# Altium schematic sheet Pressure_INPUT.SchDoc
size A3
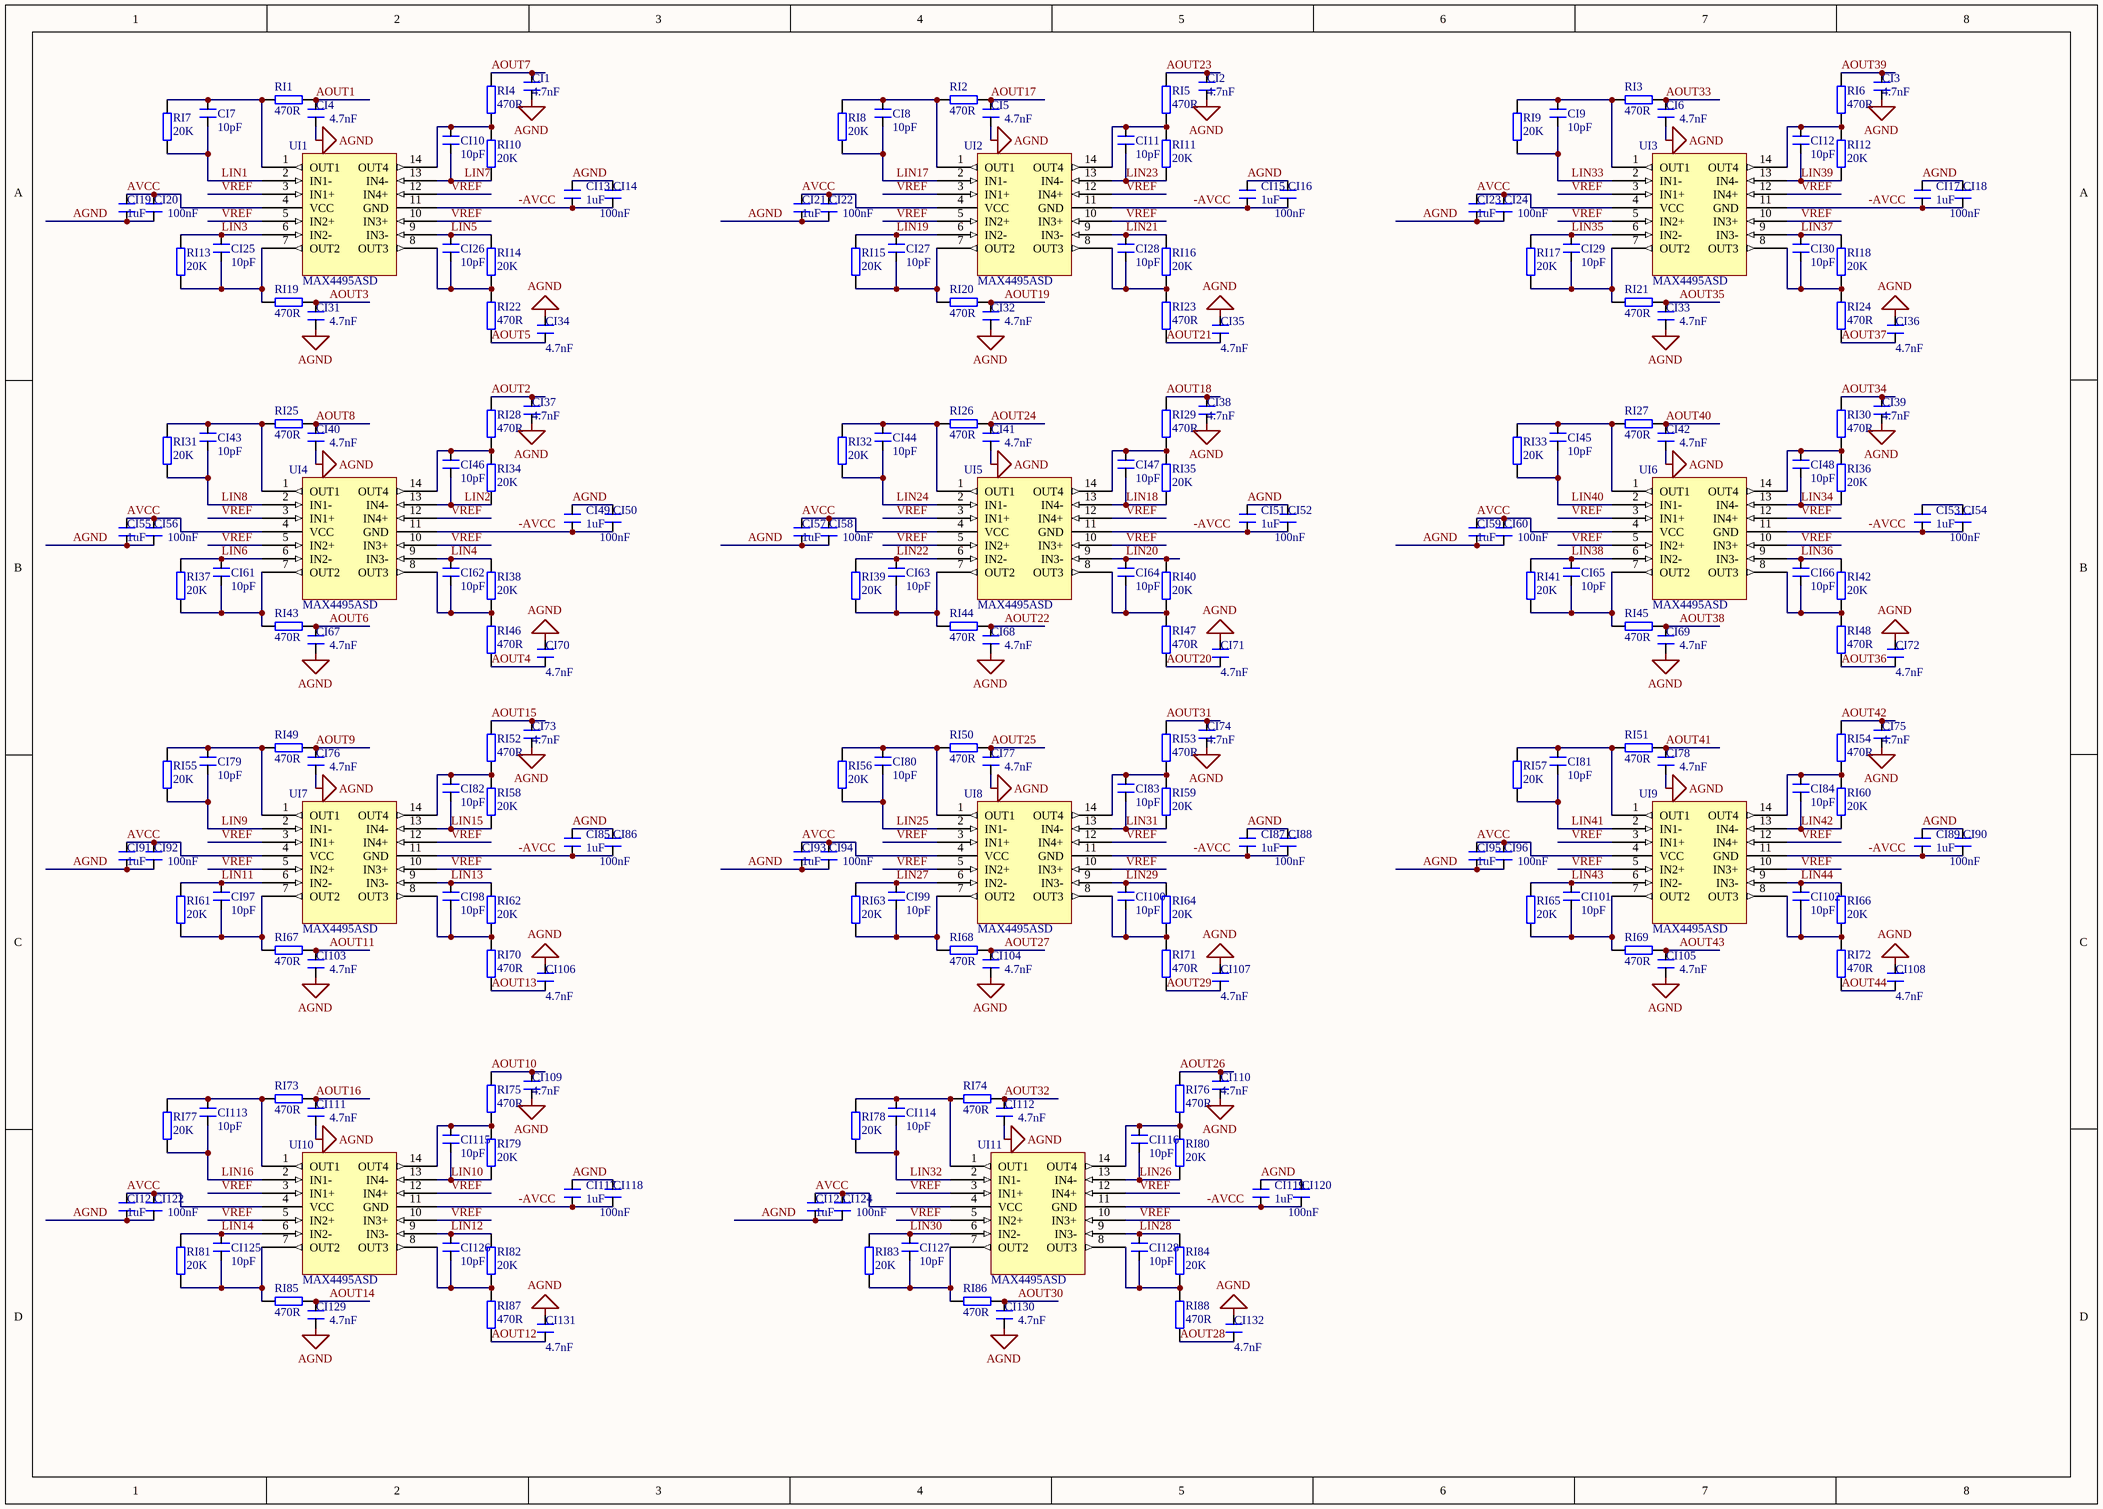
[diagram p0: Pressure_INPUT.SchDoc]

## Parts
CI1  4.7nF  [C0603_HSC100]
CI2  4.7nF  [C0603_HSC100]
CI3  4.7nF  [C0603_HSC100]
CI4  4.7nF  [C0603_HSC100]
CI5  4.7nF  [C0603_HSC100]
CI6  4.7nF  [C0603_HSC100]
CI7  10pF  [C0603_HSC100]
CI8  10pF  [C0603_HSC100]
CI9  10pF  [C0603_HSC100]
CI10  10pF  [C0603_HSC100]
CI11  10pF  [C0603_HSC100]
CI12  10pF  [C0603_HSC100]
CI13  1uF  [C0603_HSC100]
CI14  100nF  [C0603_HSC100]
CI15  1uF  [C0603_HSC100]
CI16  100nF  [C0603_HSC100]
CI17  1uF  [C0603_HSC100]
CI18  100nF  [C0603_HSC100]
CI19  1uF  [C0603_HSC100]
CI20  100nF  [C0603_HSC100]
CI21  1uF  [C0603_HSC100]
CI22  100nF  [C0603_HSC100]
CI23  1uF  [C0603_HSC100]
CI24  100nF  [C0603_HSC100]
CI25  10pF  [C0603_HSC100]
CI26  10pF  [C0603_HSC100]
CI27  10pF  [C0603_HSC100]
CI28  10pF  [C0603_HSC100]
CI29  10pF  [C0603_HSC100]
CI30  10pF  [C0603_HSC100]
CI31  4.7nF  [C0603_HSC100]
CI32  4.7nF  [C0603_HSC100]
CI33  4.7nF  [C0603_HSC100]
CI34  4.7nF  [C0603_HSC100]
CI35  4.7nF  [C0603_HSC100]
CI36  4.7nF  [C0603_HSC100]
CI37  4.7nF  [C0603_HSC100]
CI38  4.7nF  [C0603_HSC100]
CI39  4.7nF  [C0603_HSC100]
CI40  4.7nF  [C0603_HSC100]
CI41  4.7nF  [C0603_HSC100]
CI42  4.7nF  [C0603_HSC100]
CI43  10pF  [C0603_HSC100]
CI44  10pF  [C0603_HSC100]
CI45  10pF  [C0603_HSC100]
CI46  10pF  [C0603_HSC100]
CI47  10pF  [C0603_HSC100]
CI48  10pF  [C0603_HSC100]
CI49  1uF  [C0603_HSC100]
CI50  100nF  [C0603_HSC100]
CI51  1uF  [C0603_HSC100]
CI52  100nF  [C0603_HSC100]
CI53  1uF  [C0603_HSC100]
CI54  100nF  [C0603_HSC100]
CI55  1uF  [C0603_HSC100]
CI56  100nF  [C0603_HSC100]
CI57  1uF  [C0603_HSC100]
CI58  100nF  [C0603_HSC100]
CI59  1uF  [C0603_HSC100]
CI60  100nF  [C0603_HSC100]
CI61  10pF  [C0603_HSC100]
CI62  10pF  [C0603_HSC100]
CI63  10pF  [C0603_HSC100]
CI64  10pF  [C0603_HSC100]
CI65  10pF  [C0603_HSC100]
CI66  10pF  [C0603_HSC100]
CI67  4.7nF  [C0603_HSC100]
CI68  4.7nF  [C0603_HSC100]
CI69  4.7nF  [C0603_HSC100]
CI70  4.7nF  [C0603_HSC100]
CI71  4.7nF  [C0603_HSC100]
CI72  4.7nF  [C0603_HSC100]
CI73  4.7nF  [C0603_HSC100]
CI74  4.7nF  [C0603_HSC100]
CI75  4.7nF  [C0603_HSC100]
CI76  4.7nF  [C0603_HSC100]
CI77  4.7nF  [C0603_HSC100]
CI78  4.7nF  [C0603_HSC100]
CI79  10pF  [C0603_HSC100]
CI80  10pF  [C0603_HSC100]
CI81  10pF  [C0603_HSC100]
CI82  10pF  [C0603_HSC100]
CI83  10pF  [C0603_HSC100]
CI84  10pF  [C0603_HSC100]
CI85  1uF  [C0603_HSC100]
CI86  100nF  [C0603_HSC100]
CI87  1uF  [C0603_HSC100]
CI88  100nF  [C0603_HSC100]
CI89  1uF  [C0603_HSC100]
CI90  100nF  [C0603_HSC100]
CI91  1uF  [C0603_HSC100]
CI92  100nF  [C0603_HSC100]
CI93  1uF  [C0603_HSC100]
CI94  100nF  [C0603_HSC100]
CI95  1uF  [C0603_HSC100]
CI96  100nF  [C0603_HSC100]
CI97  10pF  [C0603_HSC100]
CI98  10pF  [C0603_HSC100]
CI99  10pF  [C0603_HSC100]
CI100  10pF  [C0603_HSC100]
CI101  10pF  [C0603_HSC100]
CI102  10pF  [C0603_HSC100]
CI103  4.7nF  [C0603_HSC100]
CI104  4.7nF  [C0603_HSC100]
CI105  4.7nF  [C0603_HSC100]
CI106  4.7nF  [C0603_HSC100]
CI107  4.7nF  [C0603_HSC100]
CI108  4.7nF  [C0603_HSC100]
CI109  4.7nF  [C0603_HSC100]
CI110  4.7nF  [C0603_HSC100]
CI111  4.7nF  [C0603_HSC100]
CI112  4.7nF  [C0603_HSC100]
CI113  10pF  [C0603_HSC100]
CI114  10pF  [C0603_HSC100]
CI115  10pF  [C0603_HSC100]
CI116  10pF  [C0603_HSC100]
CI117  1uF  [C0603_HSC100]
CI118  100nF  [C0603_HSC100]
CI119  1uF  [C0603_HSC100]
CI120  100nF  [C0603_HSC100]
CI121  1uF  [C0603_HSC100]
CI122  100nF  [C0603_HSC100]
CI123  1uF  [C0603_HSC100]
CI124  100nF  [C0603_HSC100]
CI125  10pF  [C0603_HSC100]
CI126  10pF  [C0603_HSC100]
CI127  10pF  [C0603_HSC100]
CI128  10pF  [C0603_HSC100]
CI129  4.7nF  [C0603_HSC100]
CI130  4.7nF  [C0603_HSC100]
CI131  4.7nF  [C0603_HSC100]
CI132  4.7nF  [C0603_HSC100]
RI1  470R  [R0603_HSC100]
RI2  470R  [R0603_HSC100]
RI3  470R  [R0603_HSC100]
RI4  470R  [R0603_HSC100]
RI5  470R  [R0603_HSC100]
RI6  470R  [R0603_HSC100]
RI7  20K  [R0603_HSC100]
RI8  20K  [R0603_HSC100]
RI9  20K  [R0603_HSC100]
RI10  20K  [R0603_HSC100]
RI11  20K  [R0603_HSC100]
RI12  20K  [R0603_HSC100]
RI13  20K  [R0603_HSC100]
RI14  20K  [R0603_HSC100]
RI15  20K  [R0603_HSC100]
RI16  20K  [R0603_HSC100]
RI17  20K  [R0603_HSC100]
RI18  20K  [R0603_HSC100]
RI19  470R  [R0603_HSC100]
RI20  470R  [R0603_HSC100]
RI21  470R  [R0603_HSC100]
RI22  470R  [R0603_HSC100]
RI23  470R  [R0603_HSC100]
RI24  470R  [R0603_HSC100]
RI25  470R  [R0603_HSC100]
RI26  470R  [R0603_HSC100]
RI27  470R  [R0603_HSC100]
RI28  470R  [R0603_HSC100]
RI29  470R  [R0603_HSC100]
RI30  470R  [R0603_HSC100]
RI31  20K  [R0603_HSC100]
RI32  20K  [R0603_HSC100]
RI33  20K  [R0603_HSC100]
RI34  20K  [R0603_HSC100]
RI35  20K  [R0603_HSC100]
RI36  20K  [R0603_HSC100]
RI37  20K  [R0603_HSC100]
RI38  20K  [R0603_HSC100]
RI39  20K  [R0603_HSC100]
RI40  20K  [R0603_HSC100]
RI41  20K  [R0603_HSC100]
RI42  20K  [R0603_HSC100]
RI43  470R  [R0603_HSC100]
RI44  470R  [R0603_HSC100]
RI45  470R  [R0603_HSC100]
RI46  470R  [R0603_HSC100]
RI47  470R  [R0603_HSC100]
RI48  470R  [R0603_HSC100]
RI49  470R  [R0603_HSC100]
RI50  470R  [R0603_HSC100]
RI51  470R  [R0603_HSC100]
RI52  470R  [R0603_HSC100]
RI53  470R  [R0603_HSC100]
RI54  470R  [R0603_HSC100]
RI55  20K  [R0603_HSC100]
RI56  20K  [R0603_HSC100]
RI57  20K  [R0603_HSC100]
RI58  20K  [R0603_HSC100]
RI59  20K  [R0603_HSC100]
RI60  20K  [R0603_HSC100]
RI61  20K  [R0603_HSC100]
RI62  20K  [R0603_HSC100]
RI63  20K  [R0603_HSC100]
RI64  20K  [R0603_HSC100]
RI65  20K  [R0603_HSC100]
RI66  20K  [R0603_HSC100]
RI67  470R  [R0603_HSC100]
RI68  470R  [R0603_HSC100]
RI69  470R  [R0603_HSC100]
RI70  470R  [R0603_HSC100]
RI71  470R  [R0603_HSC100]
RI72  470R  [R0603_HSC100]
RI73  470R  [R0603_HSC100]
RI74  470R  [R0603_HSC100]
RI75  470R  [R0603_HSC100]
RI76  470R  [R0603_HSC100]
RI77  20K  [R0603_HSC100]
RI78  20K  [R0603_HSC100]
RI79  20K  [R0603_HSC100]
RI80  20K  [R0603_HSC100]
RI81  20K  [R0603_HSC100]
RI82  20K  [R0603_HSC100]
RI83  20K  [R0603_HSC100]
RI84  20K  [R0603_HSC100]
RI85  470R  [R0603_HSC100]
RI86  470R  [R0603_HSC100]
RI87  470R  [R0603_HSC100]
RI88  470R  [R0603_HSC100]
UI1  MAX4495ASD  [SO-14]
UI2  MAX4495ASD  [SO-14]
UI3  MAX4495ASD  [SO-14]
UI4  MAX4495ASD  [SO-14]
UI5  MAX4495ASD  [SO-14]
UI6  MAX4495ASD  [SO-14]
UI7  MAX4495ASD  [SO-14]
UI8  MAX4495ASD  [SO-14]
UI9  MAX4495ASD  [SO-14]
UI10  MAX4495ASD  [SO-14]
UI11  MAX4495ASD  [SO-14]

## Nets
AGND: CI1.2 CI2.2 CI3.2 CI4.2 CI5.2 CI6.2 CI13.1 CI14.1 CI15.1 CI16.1 CI17.1 CI18.1 CI19.2 CI20.2 CI21.2 CI22.2 CI23.2 CI24.2 CI31.2 CI32.2 CI33.2 CI34.1 CI35.1 CI36.1 CI37.2 CI38.2 CI39.2 CI40.2 CI41.2 CI42.2 CI49.1 CI50.1 CI51.1 CI52.1 CI55.2 CI56.2 CI57.2 CI58.2 CI59.2 CI60.2 CI67.2 CI68.2 CI69.2 CI70.1 CI71.1 CI72.1 CI73.2 CI74.2 CI75.2 CI76.2 CI77.2 CI78.2 CI85.1 CI86.1 CI87.1 CI88.1 CI89.1 CI90.1 CI91.2 CI92.2 CI93.2 CI94.2 CI95.2 CI96.2 CI103.2 CI104.2 CI105.2 CI106.1 CI107.1 CI108.1 CI109.2 CI110.2 CI111.2 CI112.2 CI117.1 CI118.1 CI119.1 CI120.1 CI121.2 CI122.2 CI123.2 CI124.2 CI129.2 CI130.2 CI131.1 CI132.1
-AVCC: CI13.2 CI14.2 CI15.2 CI16.2 CI17.2 CI18.2 CI49.2 CI50.2 CI51.2 CI52.2 CI53.2 CI54.2 CI85.2 CI86.2 CI87.2 CI88.2 CI89.2 CI90.2 CI117.2 CI118.2 CI119.2 CI120.2 UI1.11(GND) UI2.11(GND) UI3.11(GND) UI4.11(GND) UI5.11(GND) UI6.11(GND) UI7.11(GND) UI8.11(GND) UI9.11(GND) UI10.11(GND) UI11.11(GND)
AOUT1: CI4.1 RI1.1
AOUT2: CI37.1 RI28.2
AOUT3: CI31.1 RI19.1
AOUT4: CI70.2 RI46.2
AOUT5: CI34.2 RI22.2
AOUT6: CI67.1 RI43.1
AOUT7: CI1.1 RI4.2
AOUT8: CI40.1 RI25.1
AOUT9: CI76.1 RI49.1
AOUT10: CI109.1 RI75.2
AOUT11: CI103.1 RI67.1
AOUT12: CI131.2 RI87.2
AOUT13: CI106.2 RI70.2
AOUT14: CI129.1 RI85.1
AOUT15: CI73.1 RI52.2
AOUT16: CI111.1 RI73.1
AOUT17: CI5.1 RI2.1
AOUT18: CI38.1 RI29.2
AOUT19: CI32.1 RI20.1
AOUT20: CI71.2 RI47.2
AOUT21: CI35.2 RI23.2
AOUT22: CI68.1 RI44.1
AOUT23: CI2.1 RI5.2
AOUT24: CI41.1 RI26.1
AOUT25: CI77.1 RI50.1
AOUT26: CI110.1 RI76.2
AOUT27: CI104.1 RI68.1
AOUT28: CI132.2 RI88.2
AOUT29: CI107.2 RI71.2
AOUT30: CI130.1 RI86.1
AOUT31: CI74.1 RI53.2
AOUT32: CI112.1 RI74.1
AOUT33: CI6.1 RI3.1
AOUT34: CI39.1 RI30.2
AOUT35: CI33.1 RI21.1
AOUT36: CI72.2 RI48.2
AOUT37: CI36.2 RI24.2
AOUT38: CI69.1 RI45.1
AOUT39: CI3.1 RI6.2
AOUT40: CI42.1 RI27.1
AOUT41: CI78.1 RI51.1
AOUT42: CI75.1 RI54.2
AOUT43: CI105.1 RI69.1
AOUT44: CI108.2 RI72.2
AVCC: CI19.1 CI20.1 CI21.1 CI22.1 CI23.1 CI24.1 CI55.1 CI56.1 CI57.1 CI58.1 CI59.1 CI60.1 CI91.1 CI92.1 CI93.1 CI94.1 CI95.1 CI96.1 CI121.1 CI122.1 CI123.1 CI124.1 UI1.4(VCC) UI2.4(VCC) UI3.4(VCC) UI4.4(VCC) UI5.4(VCC) UI6.4(VCC) UI7.4(VCC) UI8.4(VCC) UI9.4(VCC) UI10.4(VCC) UI11.4(VCC)
LIN1: CI7.2 RI7.1 UI1.2(IN1-)
LIN2: CI46.2 RI34.1 UI4.13(IN4-)
LIN3: CI25.1 RI13.1 UI1.6(IN2-)
LIN4: CI62.1 RI38.2 UI4.9(IN3-)
LIN5: CI26.1 RI14.2 UI1.9(IN3-)
LIN6: CI61.1 RI37.1 UI4.6(IN2-)
LIN7: CI10.2 RI10.1 UI1.13(IN4-)
LIN8: CI43.2 RI31.1 UI4.2(IN1-)
LIN9: CI79.2 RI55.1 UI7.2(IN1-)
LIN10: CI115.2 RI79.1 UI10.13(IN4-)
LIN11: CI97.1 RI61.1 UI7.6(IN2-)
LIN12: CI126.1 RI82.2 UI10.9(IN3-)
LIN13: CI98.1 RI62.2 UI7.9(IN3-)
LIN14: CI125.1 RI81.1 UI10.6(IN2-)
LIN15: CI82.2 RI58.1 UI7.13(IN4-)
LIN16: CI113.2 RI77.1 UI10.2(IN1-)
LIN17: CI8.2 RI8.1 UI2.2(IN1-)
LIN18: CI47.2 RI35.1 UI5.13(IN4-)
LIN19: CI27.1 RI15.1 UI2.6(IN2-)
LIN20: CI64.1 RI40.2 UI5.9(IN3-)
LIN21: CI28.1 RI16.2 UI2.9(IN3-)
LIN22: CI63.1 RI39.1 UI5.6(IN2-)
LIN23: CI11.2 RI11.1 UI2.13(IN4-)
LIN24: CI44.2 RI32.1 UI5.2(IN1-)
LIN25: CI80.2 RI56.1 UI8.2(IN1-)
LIN26: CI116.2 RI80.1 UI11.13(IN4-)
LIN27: CI99.1 RI63.1 UI8.6(IN2-)
LIN28: CI128.1 RI84.2 UI11.9(IN3-)
LIN29: CI100.1 RI64.2 UI8.9(IN3-)
LIN30: CI127.1 RI83.1 UI11.6(IN2-)
LIN31: CI83.2 RI59.1 UI8.13(IN4-)
LIN32: CI114.2 RI78.1 UI11.2(IN1-)
LIN33: CI9.2 RI9.1 UI3.2(IN1-)
LIN34: CI48.2 RI36.1 UI6.13(IN4-)
LIN35: CI29.1 RI17.1 UI3.6(IN2-)
LIN36: CI66.1 RI42.2 UI6.9(IN3-)
LIN37: CI30.1 RI18.2 UI3.9(IN3-)
LIN38: CI65.1 RI41.1 UI6.6(IN2-)
LIN39: CI12.2 RI12.1 UI3.13(IN4-)
LIN40: CI45.2 RI33.1 UI6.2(IN1-)
LIN41: CI81.2 RI57.1 UI9.2(IN1-)
LIN42: CI84.2 RI60.1 UI9.13(IN4-)
LIN43: CI101.1 RI65.1 UI9.6(IN2-)
LIN44: CI102.1 RI66.2 UI9.9(IN3-)
VREF: UI1.3(IN1+) UI1.5(IN2+) UI1.10(IN3+) UI1.12(IN4+) UI2.3(IN1+) UI2.5(IN2+) UI2.10(IN3+) UI2.12(IN4+) UI3.3(IN1+) UI3.5(IN2+) UI3.10(IN3+) UI3.12(IN4+) UI4.3(IN1+) UI4.5(IN2+) UI4.10(IN3+) UI4.12(IN4+) UI5.3(IN1+) UI5.5(IN2+) UI5.10(IN3+) UI5.12(IN4+) UI6.3(IN1+) UI6.5(IN2+) UI6.10(IN3+) UI6.12(IN4+) UI7.3(IN1+) UI7.5(IN2+) UI7.10(IN3+) UI7.12(IN4+) UI8.3(IN1+) UI8.5(IN2+) UI8.10(IN3+) UI8.12(IN4+) UI9.3(IN1+) UI9.5(IN2+) UI9.10(IN3+) UI9.12(IN4+) UI10.3(IN1+) UI10.5(IN2+) UI10.10(IN3+) UI10.12(IN4+) UI11.3(IN1+) UI11.5(IN2+) UI11.10(IN3+) UI11.12(IN4+)
NetCI7_1: CI7.1 RI1.2 RI7.2 UI1.1(OUT1)
NetCI8_1: CI8.1 RI2.2 RI8.2 UI2.1(OUT1)
NetCI9_1: CI9.1 RI3.2 RI9.2 UI3.1(OUT1)
NetCI10_1: CI10.1 RI4.1 RI10.2 UI1.14(OUT4)
NetCI11_1: CI11.1 RI5.1 RI11.2 UI2.14(OUT4)
NetCI12_1: CI12.1 RI6.1 RI12.2 UI3.14(OUT4)
NetCI25_2: CI25.2 RI13.2 RI19.2 UI1.7(OUT2)
NetCI26_2: CI26.2 RI14.1 RI22.1 UI1.8(OUT3)
NetCI27_2: CI27.2 RI15.2 RI20.2 UI2.7(OUT2)
NetCI28_2: CI28.2 RI16.1 RI23.1 UI2.8(OUT3)
NetCI29_2: CI29.2 RI17.2 RI21.2 UI3.7(OUT2)
NetCI30_2: CI30.2 RI18.1 RI24.1 UI3.8(OUT3)
NetCI43_1: CI43.1 RI25.2 RI31.2 UI4.1(OUT1)
NetCI44_1: CI44.1 RI26.2 RI32.2 UI5.1(OUT1)
NetCI45_1: CI45.1 RI27.2 RI33.2 UI6.1(OUT1)
NetCI46_1: CI46.1 RI28.1 RI34.2 UI4.14(OUT4)
NetCI47_1: CI47.1 RI29.1 RI35.2 UI5.14(OUT4)
NetCI48_1: CI48.1 RI30.1 RI36.2 UI6.14(OUT4)
NetCI53_1: CI53.1 CI54.1
NetCI61_2: CI61.2 RI37.2 RI43.2 UI4.7(OUT2)
NetCI62_2: CI62.2 RI38.1 RI46.1 UI4.8(OUT3)
NetCI63_2: CI63.2 RI39.2 RI44.2 UI5.7(OUT2)
NetCI64_2: CI64.2 RI40.1 RI47.1 UI5.8(OUT3)
NetCI65_2: CI65.2 RI41.2 RI45.2 UI6.7(OUT2)
NetCI66_2: CI66.2 RI42.1 RI48.1 UI6.8(OUT3)
NetCI79_1: CI79.1 RI49.2 RI55.2 UI7.1(OUT1)
NetCI80_1: CI80.1 RI50.2 RI56.2 UI8.1(OUT1)
NetCI81_1: CI81.1 RI51.2 RI57.2 UI9.1(OUT1)
NetCI82_1: CI82.1 RI52.1 RI58.2 UI7.14(OUT4)
NetCI83_1: CI83.1 RI53.1 RI59.2 UI8.14(OUT4)
NetCI84_1: CI84.1 RI54.1 RI60.2 UI9.14(OUT4)
NetCI97_2: CI97.2 RI61.2 RI67.2 UI7.7(OUT2)
NetCI98_2: CI98.2 RI62.1 RI70.1 UI7.8(OUT3)
NetCI99_2: CI99.2 RI63.2 RI68.2 UI8.7(OUT2)
NetCI100_2: CI100.2 RI64.1 RI71.1 UI8.8(OUT3)
NetCI101_2: CI101.2 RI65.2 RI69.2 UI9.7(OUT2)
NetCI102_2: CI102.2 RI66.1 RI72.1 UI9.8(OUT3)
NetCI113_1: CI113.1 RI73.2 RI77.2 UI10.1(OUT1)
NetCI114_1: CI114.1 RI74.2 RI78.2 UI11.1(OUT1)
NetCI115_1: CI115.1 RI75.1 RI79.2 UI10.14(OUT4)
NetCI116_1: CI116.1 RI76.1 RI80.2 UI11.14(OUT4)
NetCI125_2: CI125.2 RI81.2 RI85.2 UI10.7(OUT2)
NetCI126_2: CI126.2 RI82.1 RI87.1 UI10.8(OUT3)
NetCI127_2: CI127.2 RI83.2 RI86.2 UI11.7(OUT2)
NetCI128_2: CI128.2 RI84.1 RI88.1 UI11.8(OUT3)

## Library data of the parts
CI1-CI132 = CAP_M
RI1-RI88 = RES
UI1-UI11 = LM324